# EAGLE design bb (EAGLE 6.5.0)
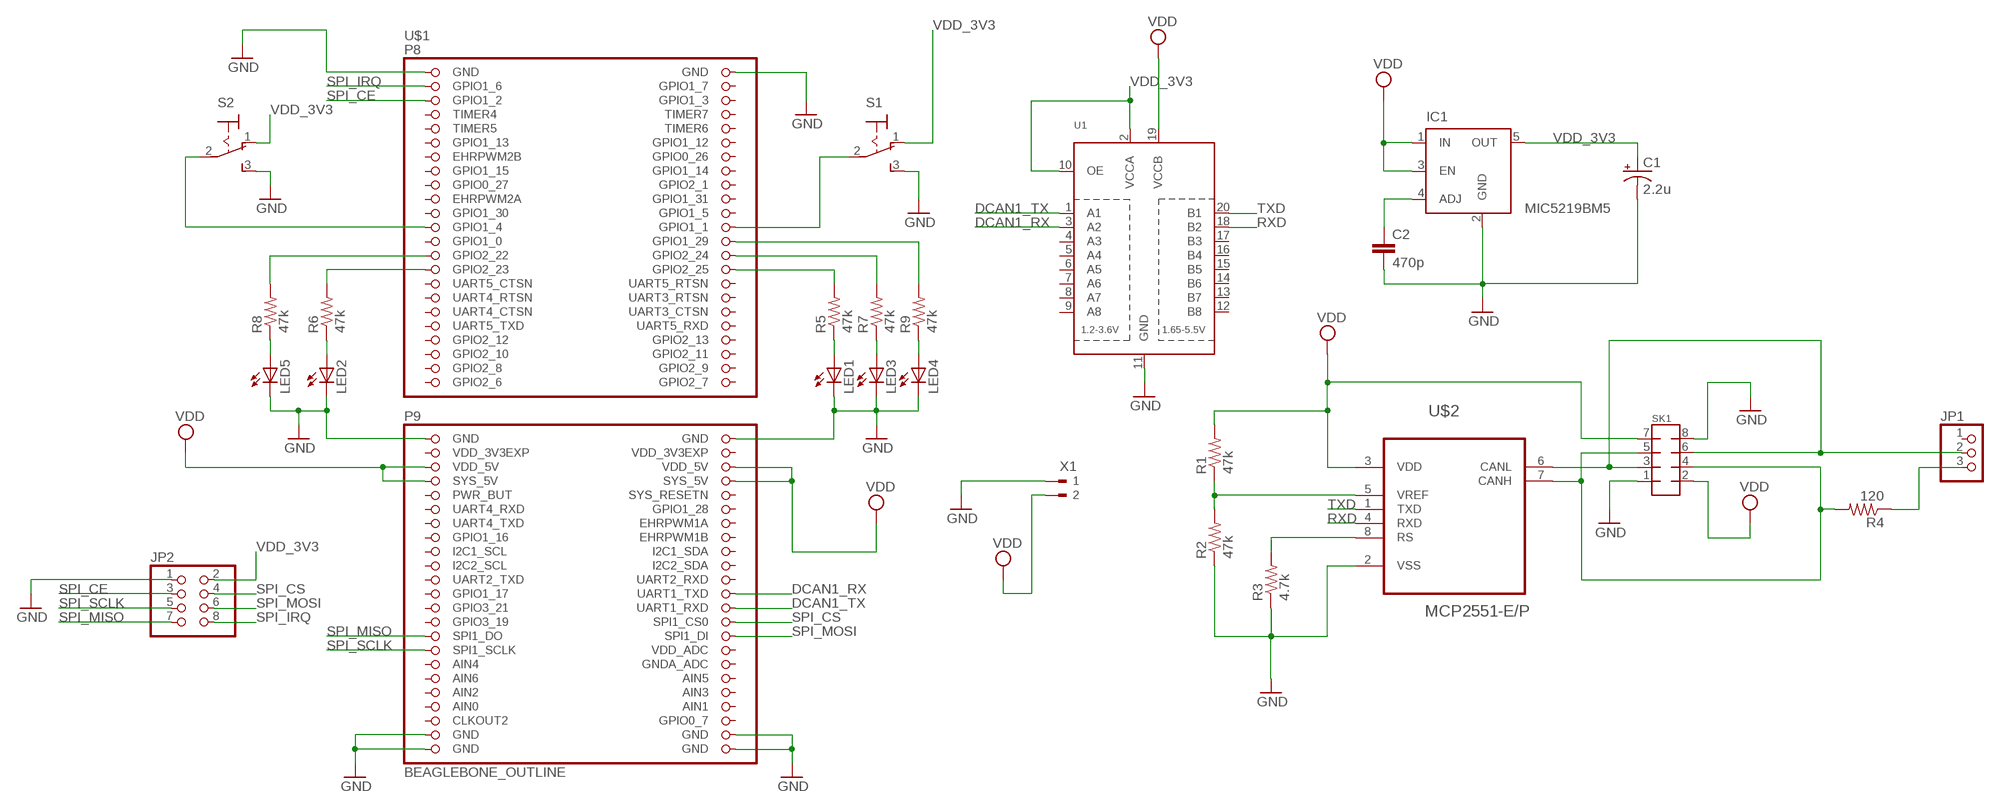
[diagram p0: schematic, sheet 1]

## Parts
C1  2.2u  CPOL-USE5-4  [E5-4]
C2  470p  C-EU025-040X050  [C025-040X050]
IC1  MIC5219BM5  [SOT23-5]
JP1  PINHD-1X3  [1X03]
JP2  PINHD-2X4  [2X04]
LED1  LED5MM  [LED5MM]
LED2  LED5MM  [LED5MM]
LED3  LED5MM  [LED5MM]
LED4  LED5MM  [LED5MM]
LED5  LED5MM  [LED5MM]
R1  47k  R-US_0207/9  [0207/9]
R2  47k  R-US_0207/9  [0207/9]
R3  4.7k  R-US_0207/9  [0207/9]
R4  120  R-US_0207/9  [0207/9]
R5  47k  R-US_0207/9  [0207/9]
R6  47k  R-US_0207/9  [0207/9]
R7  47k  R-US_0207/9  [0207/9]
R8  47k  R-US_0207/9  [0207/9]
R9  47k  R-US_0207/9  [0207/9]
S1  320-916  [320-916]
S2  320-916  [320-916]
SK1  MMATCH-8-PTH  [AMP-215079-8]
U1  TXB0108PWR  [TSSOP20]
U$1  BEAGLEBONE_OUTLINE  [BEAGLEBONE_SHIELD]
U$2  MCP2551-E/P  [DIP254P762X432-8]
X1  180G-2  [180G-2]

## Nets
DCAN1_RX: U1.3(A2) U$1.70(UART1_TXD)
DCAN1_TX: U1.1(A1) U$1.72(UART1_RXD)
GND: C1.- C2.2 IC1.2(GND) JP2.1 LED1.K(C) LED2.K(C) LED3.K(C) LED4.K(C) LED5.K(C) R2.1 R3.1 S1.3(S) S2.3(S) SK1.1 SK1.8 U1.11(GND) U$1.1(GND) U$1.2(GND) U$1.47(GND) U$1.48(GND) U$1.89(GND) U$1.90(GND) U$1.91(GND) U$1.92(GND) U$2.2(VSS) X1.1
N$1: R1.1 R2.2 U$2.5(VREF)
N$2: JP1.3 R4.1
N$3: R3.2 U$2.8(RS)
N$4: C2.1 IC1.4(ADJ)
N$5: R5.2 U$1.30(GPIO2_25)
N$6: R6.2 U$1.29(GPIO2_23)
N$7: R7.2 U$1.28(GPIO2_24)
N$9: R9.2 U$1.26(GPIO1_29)
N$10: LED5.A R8.1
N$11: S1.2(P) U$1.24(GPIO1_1)
N$12: S2.2(P) U$1.23(GPIO1_4)
N$13: R8.2 U$1.27(GPIO2_22)
N$15: JP1.2 SK1.3 SK1.6 U$2.6(CANL)
N$16: R4.2 SK1.4 SK1.5 U$2.7(CANH)
N$19: LED2.A R6.1
N$20: LED1.A R5.1
N$21: LED3.A R7.1
N$22: LED4.A R9.1
RXD: U1.18(B2) U$2.4(RXD)
SPI_CE: JP2.3 U$1.5(GPIO1_2)
SPI_CS: JP2.4 U$1.74(SPI1_CS0)
SPI_IRQ: JP2.8 U$1.3(GPIO1_6)
SPI_MISO: JP2.7 U$1.75(SPI1_DO)
SPI_MOSI: JP2.6 U$1.76(SPI1_DI)
SPI_SCLK: JP2.5 U$1.77(SPI1_SCLK)
TXD: U1.20(B1) U$2.1(TXD)
VDD: IC1.1(IN) IC1.3(EN) R1.2 SK1.2 SK1.7 U1.19(VCCB) U$1.51(VDD_5V) U$1.52(VDD_5V) U$1.53(SYS_5V) U$1.54(SYS_5V) U$2.3(VDD) X1.2
VDD_3V3: C1.+ IC1.5(OUT) JP2.2 S1.1(O) S2.1(O) U1.2(VCCA) U1.10(OE)
Unconnected: JP1.1 U1.4(A3) U1.5(A4) U1.6(A5) U1.7(A6) U1.8(A7) U1.9(A8) U1.12(B8) U1.13(B7) U1.14(B6) U1.15(B5) U1.16(B4) U1.17(B3) U$1.4(GPIO1_7) U$1.6(GPIO1_3) U$1.7(TIMER4) U$1.8(TIMER7) U$1.9(TIMER5) U$1.10(TIMER6) U$1.11(GPIO1_13) U$1.12(GPIO1_12) U$1.13(EHRPWM2B) U$1.14(GPIO0_26) U$1.15(GPIO1_15) U$1.16(GPIO1_14) U$1.17(GPIO0_27) U$1.18(GPIO2_1) U$1.19(EHRPWM2A) U$1.20(GPIO1_31) U$1.21(GPIO1_30) U$1.22(GPIO1_5) U$1.25(GPIO1_0) U$1.31(UART5_CTSN) U$1.32(UART5_RTSN) U$1.33(UART4_RTSN) U$1.34(UART3_RTSN) U$1.35(UART4_CTSN) U$1.36(UART3_CTSN) U$1.37(UART5_TXD) U$1.38(UART5_RXD) U$1.39(GPIO2_12) U$1.40(GPIO2_13) U$1.41(GPIO2_10) U$1.42(GPIO2_11) U$1.43(GPIO2_8) U$1.44(GPIO2_9) U$1.45(GPIO2_6) U$1.46(GPIO2_7) U$1.55(PWR_BUT) U$1.56(SYS_RESETN) U$1.57(UART4_RXD) U$1.58(GPIO1_28) U$1.59(UART4_TXD) U$1.60(EHRPWM1A) U$1.61(GPIO1_16) U$1.62(EHRPWM1B) U$1.63(I2C1_SCL) U$1.64(I2C1_SDA) U$1.65(I2C2_SCL) U$1.66(I2C2_SDA) U$1.67(UART2_TXD) U$1.68(UART2_RXD) U$1.69(GPIO1_17) U$1.71(GPIO3_21) U$1.73(GPIO3_19) U$1.78(VDD_ADC) U$1.79(AIN4) U$1.80(GNDA_ADC) U$1.81(AIN6) U$1.82(AIN5) U$1.83(AIN2) U$1.84(AIN3) U$1.86(AIN1) U$1.87(CLKOUT2) U$1.88(GPIO0_7)

## Power pins joined to a net without a drawn wire
AIN0: U$1.85(AIN0)
VDD_3V3EXP: U$1.49(VDD_3V3EXP) U$1.50(VDD_3V3EXP)

## Library data of the parts
C1 = resistor:CPOL-US: POLARIZED CAPACITOR, American symbol
C2 = resistor:C-EU: CAPACITOR, European symbol
IC1 = v-reg-micrel:MIC5219BM5: VOLTAGE REGULATOR; MF: ALTERA CORPORATION; MPN: MIC5219BM5 TR; OC_FARNELL: 1100656; OC_NEWARK: 09J8939
JP1 = adafruit:PINHD-1X3: PIN HEADER
JP2 = adafruit:PINHD-2X4: PIN HEADER
LED1-LED5 = adafruit:LED: LED OSRAM: - CHIPLED LG R971, LG N971, LY N971, LG Q971, LY Q971, LO R971, LY R971 LH N974, LH R974 LS Q976, LO Q976, LY Q976 LO Q996 - Hyper CHIPLED LW Q18S LB Q993, LB Q99A, LB R99A - SideLED LS A670, LO A670, LY A670, LG A670, LP A670 LB A673, LV A673, LT A673, LW A673 LH A674 LY A675 LS A676, LA A676, LO A676, LY A676, LW A676 LS A679, LY A679, LG A679 - Hyper Micro SIDELED® LS Y876, LA Y876, LO Y876, LY Y876 LT Y87S - SmartLED LW L88C, LW L88S LB L89C, LB L89S, LG L890 LS L89K, LO L89K, LY L89K LS L896, LA L896, LO L896, LY L896 - TOPLED LS T670, LO T670, LY T670, LG T670, LP T670 LSG T670, LSP T670, LSY T670, LOP T670, LYG T670 LG T671, LOG T671, LSG T671 LB T673, LV T673, LT T673, LW T673 LH T674 LS T676, LA T676, LO T676, LY T676, LB T676, LH T676, LSB T676, LW T676 LB T67C, LV T67C, LT T67C, LS T67K, LO T67K, LY T67K, LW E67C LS E67B, LA E67B, LO E67B, LY E67B, LB E67C, LV E67C, LT E67C LW T67C LS T679, LY T679, LG T679 LS T770, LO T770, LY T770, LG T770, LP T770 LB T773, LV T773, LT T773, LW T773 LH T774 LS E675, LA E675, LY E675, LS T675 LS T776, LA T776, LO T776, LY T776, LB T776 LHGB T686 LT T68C, LB T68C - Hyper Mini TOPLED® LB M676 - Mini TOPLED Santana® LG M470 LS M47K, LO M47K, LY M47K Source: http://www.osram.convergy.de/
R1-R9 = adafruit:R-US_: RESISTOR, American symbol
S1 S2 = switch:320-916: TOGGLE SWITCH distributor RS Components
SK1 = jt-con-micromatch:MMATCH-8-*: AMP Micromatch 8-pin
U1 = adafruit:TXB0108PWR: 8-Bit Bi-Directional Level Shifter 1.2V-3.6V (VCCA) to 1.65V-5.5V (VCCB) bi-directional level shifter with auto direction sensing. Max data rate - VCCA 1.8V: 20Mbps (50ns), VCCA 3.3V: 100Mbps (10ns) Digikey: 296-21527-1-ND
U$1 = adafruit:BEAGLEBONE_OUTLINE: Should match A3 pinout - but not completely tested
U$2 = mcp2551:MCP2551-E/P: High-Speed CAN Transceiver; MPN: MCP2551-E/P; OC_FARNELL: 1439745; OC_NEWARK: 69K7603; PACKAGE: DIP-8; SUPPLIER: Microchip
X1 = con-weidmueller-sl35:180G-2: WEIDMUELLER CLAMP CONNECTOR; OC_FARNELL: unknown; OC_NEWARK: unknown

## Board
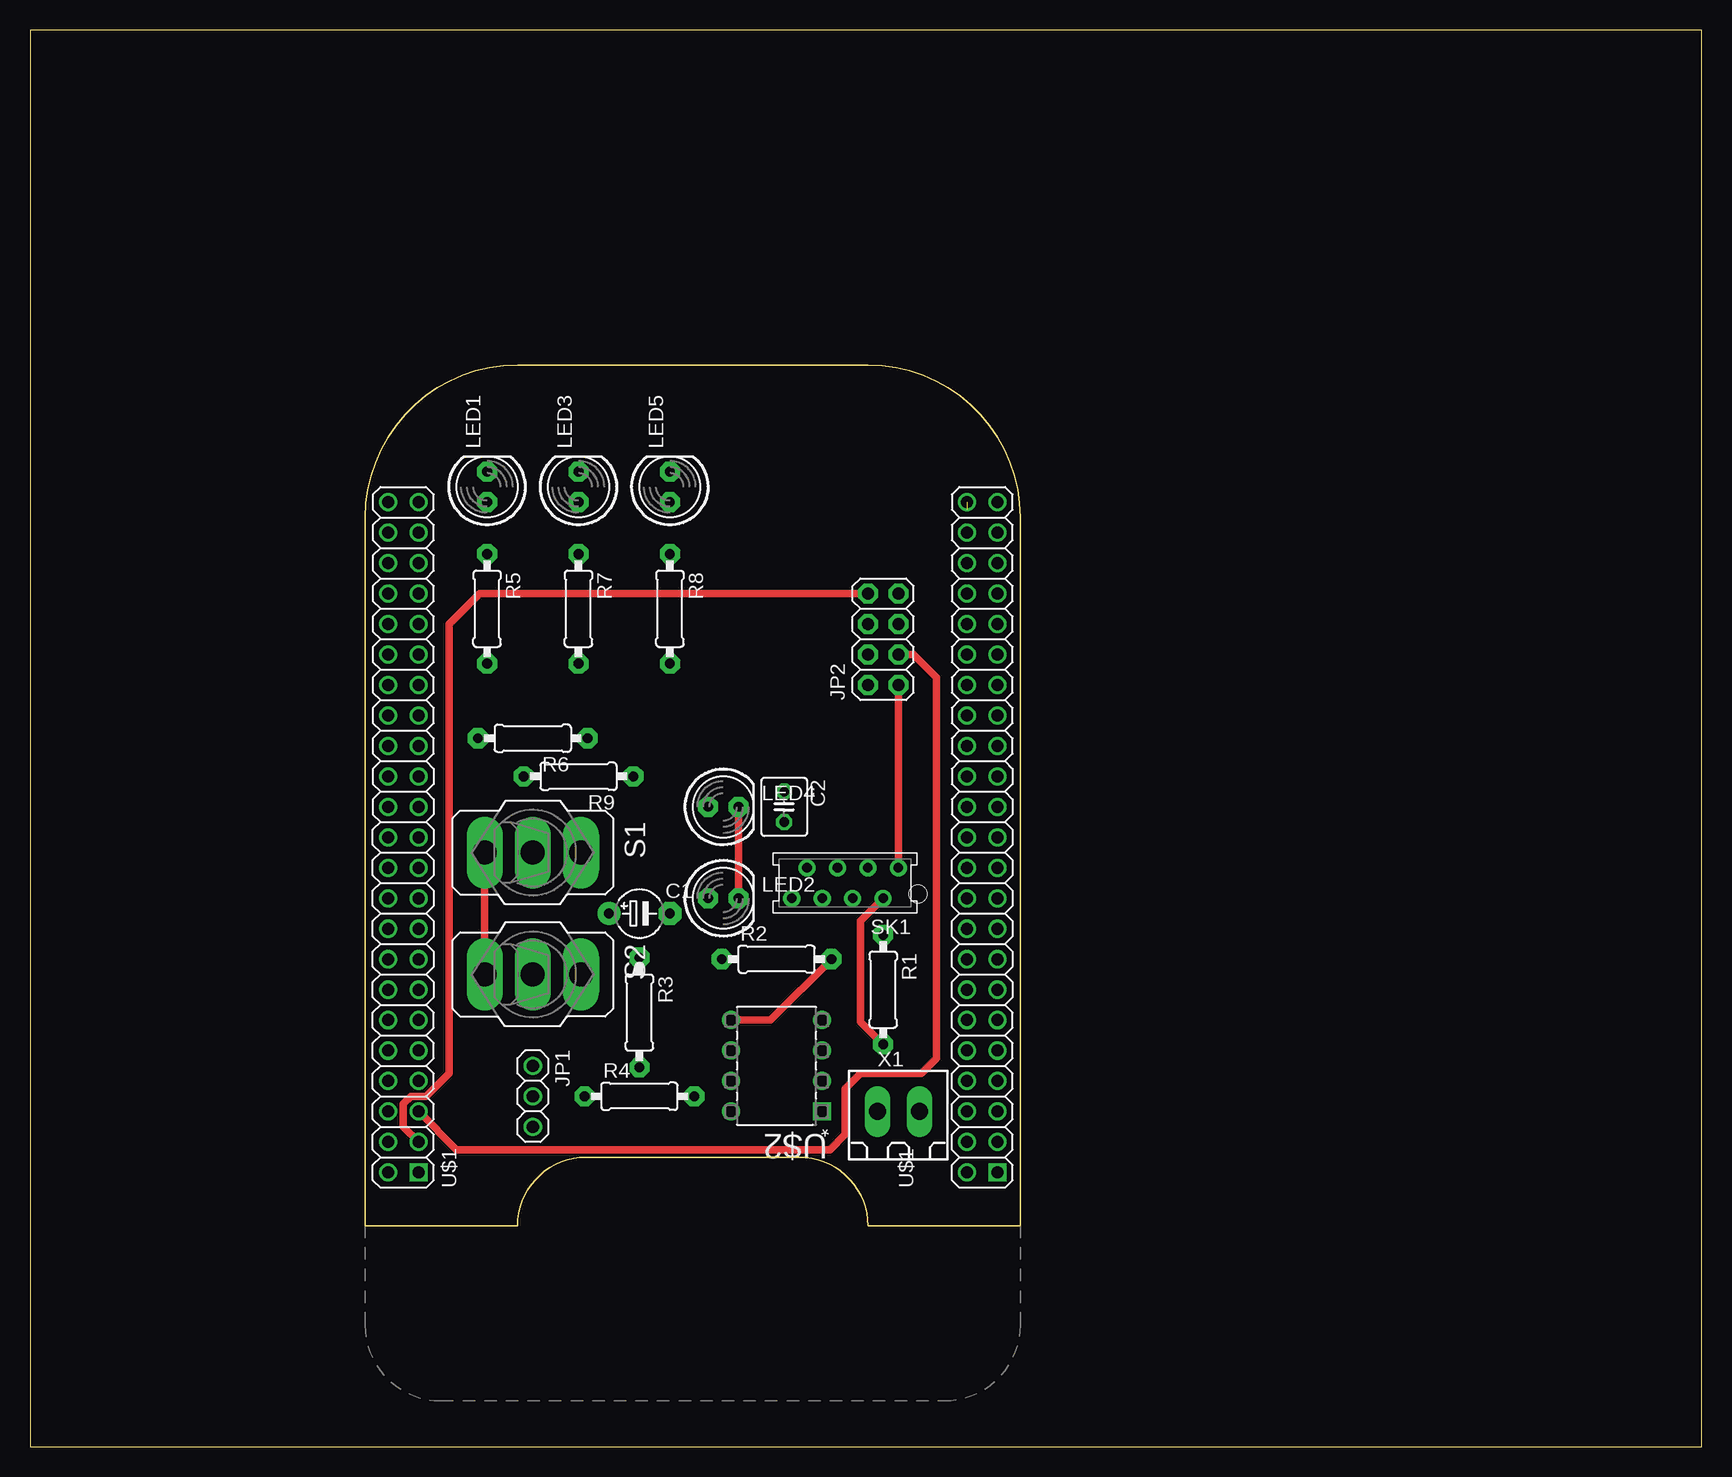
[diagram p1: board, top side]
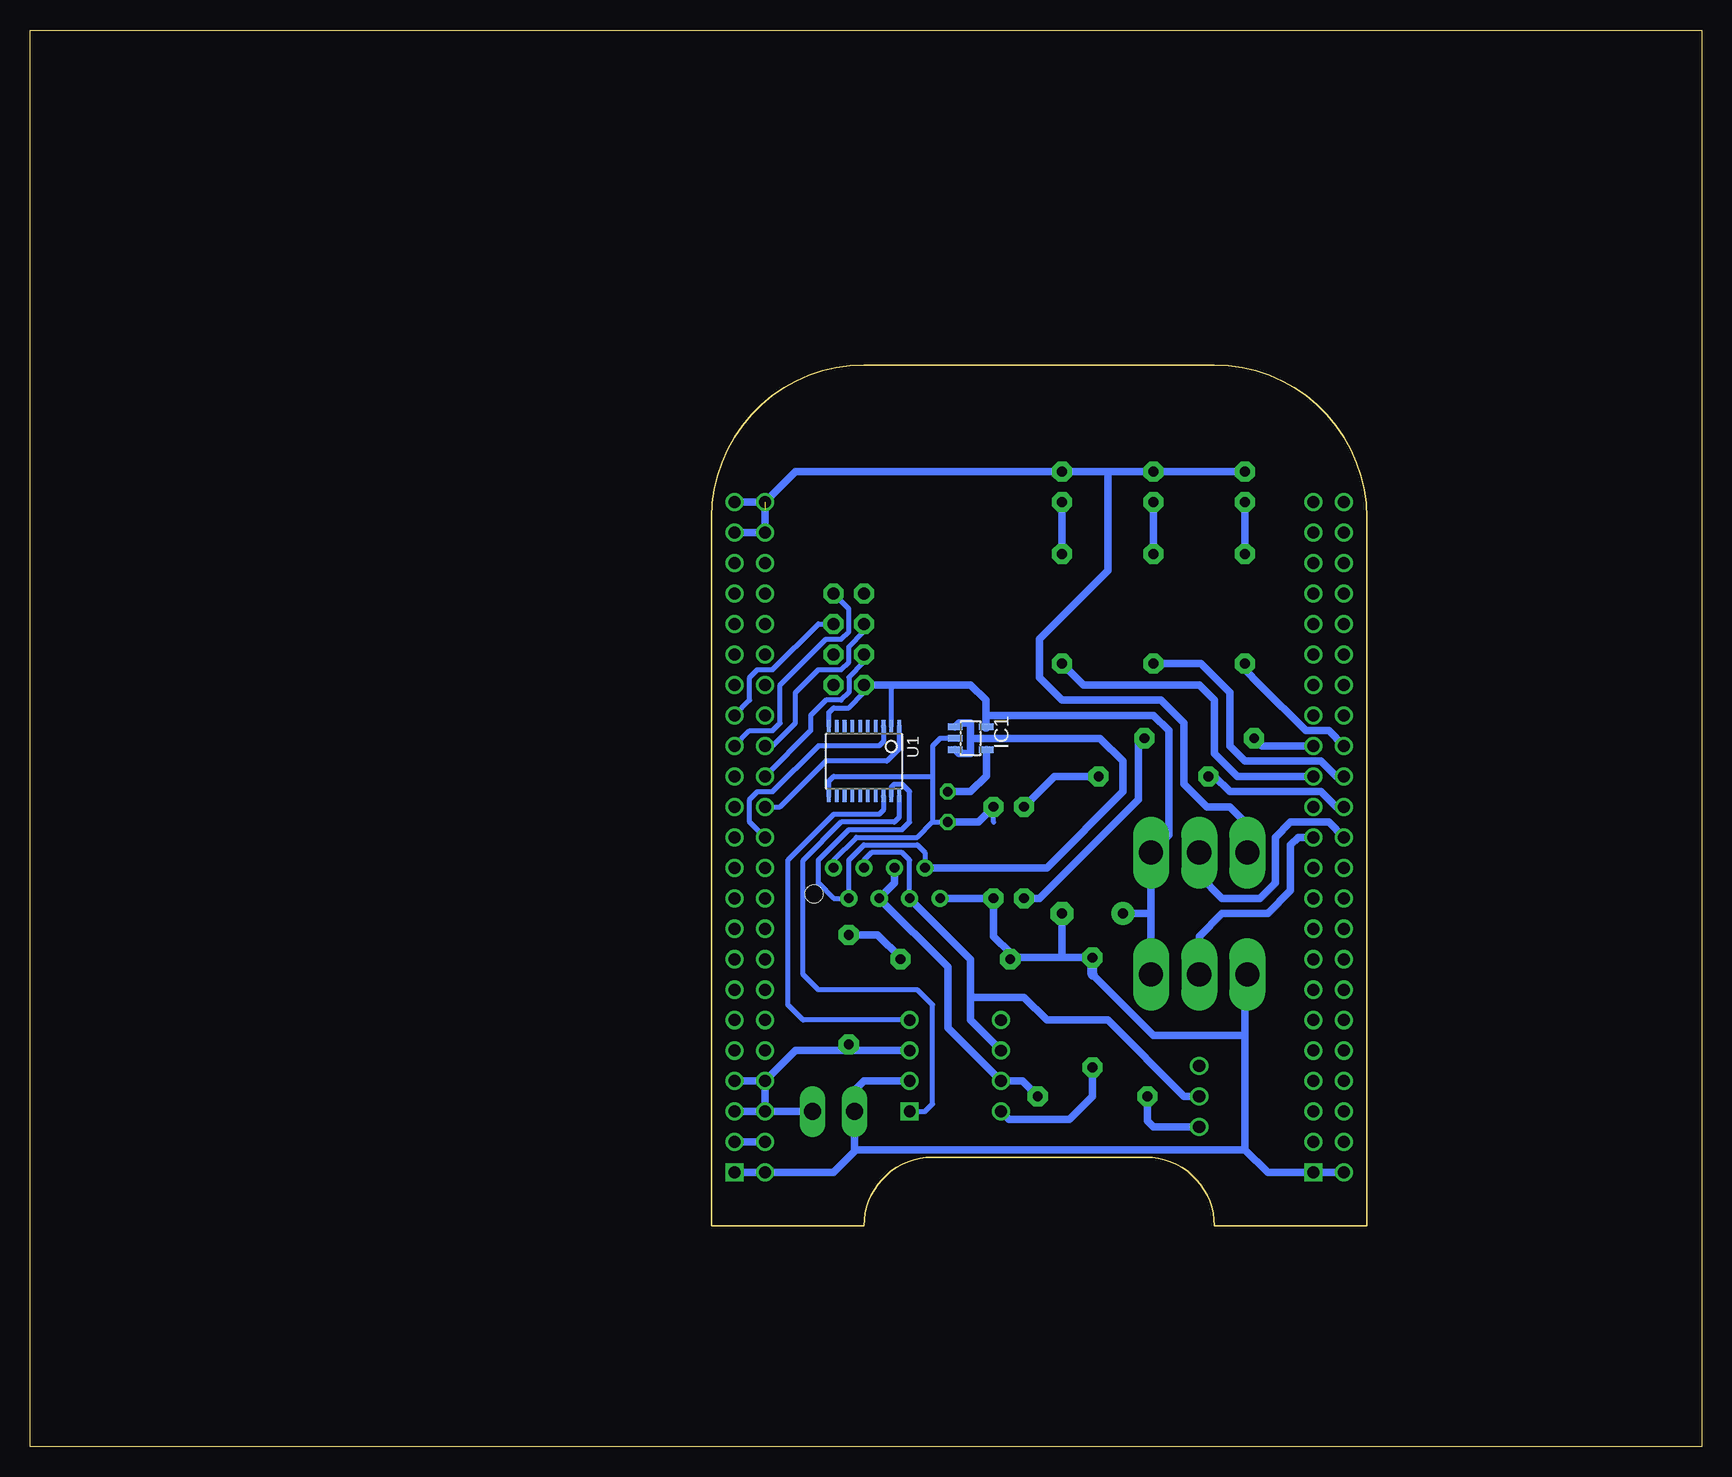
[diagram p2: board, bottom side, seen from below]

Size 139.37 x 118.1 mm. Coordinates in mm from the lower left corner, seen from the top.
Outline: 0,0 139.37,0 139.37,118.1 0,118.1 0,0
Copper layers (1*16): Top 0.035mm / dielectric 1.5mm / Bottom 0.035mm
Design rules "default": minimum track width 10mil, minimum drill 24mil, track to track 8mil, track to pad 8mil, pad to pad 8mil, via to via 8mil, smd to smd 8mil, copper to edge 40mil, drill to drill 8mil, minimum pad ring 10mil, minimum via ring 8mil, stop-mask expansion 4mil, vias tented up to drill 0mil, thermal gap 10mil

### Footprints (pad centres in the part's own frame; a part is rotated, then mirrored left to right if it is on the bottom)
E5-4 = drill 0.813 pad 1.905: + -2.54,0 | drill 0.813 pad 1.905 octagon: - 2.54,0
C025-040X050 = drill 0.813 octagon: 1 -1.27,0; 2 1.27,0
SOT23-5 = smd 0.55 x 1.2: 1 -0.95,-1.3; 2 0,-1.3; 3 0.95,-1.3; 4 0.95,1.3; 5 -0.95,1.3
1X03 = drill 1.016: 1 -2.54,0; 2 0,0; 3 2.54,0
2X04 = drill 1.016 pad 1.676 octagon: 1 -3.81,-1.27; 2 -3.81,1.27; 3 -1.27,-1.27; 4 -1.27,1.27; 5 1.27,-1.27; 6 1.27,1.27; 7 3.81,-1.27; 8 3.81,1.27
LED5MM = drill 0.813 pad 1.676 octagon: A -1.27,0; K 1.27,0
0207/9 = drill 0.813 pad 1.676 octagon: 1 -4.572,0; 2 4.572,0
320-916 = drill 2.007 long: 1 0,4.013; 2 0,0; 3 0,-4.013
AMP-215079-8 = drill 0.8 pad 1.422: 1 0,-1.27; 2 1.27,1.27; 3 2.54,-1.27; 4 3.81,1.27; 5 5.08,-1.27; 6 6.35,1.27; 7 7.62,-1.27; 8 8.89,1.27 | hole 1.5: -1.62,0.905
TSSOP20 = smd 0.305 x 0.991: 1 -2.925,-2.918; 2 -2.275,-2.918; 3 -1.625,-2.918; 4 -0.975,-2.918; 5 -0.325,-2.918; 6 0.325,-2.918; 7 0.975,-2.918; 8 1.625,-2.918; 9 2.275,-2.918; 10 2.925,-2.918; 11 2.925,2.918; 12 2.275,2.918; 13 1.625,2.918; 14 0.975,2.918; 15 0.325,2.918; 16 -0.325,2.918; 17 -0.975,2.918; 18 -1.625,2.918; 19 -2.275,2.918; 20 -2.925,2.918
BEAGLEBONE_SHIELD = drill 1 square: 1 4.445,19.05; 47 52.705,19.05 | drill 1: 2 1.905,19.05; 3 4.445,21.59; 4 1.905,21.59; 5 4.445,24.13; 6 1.905,24.13; 7 4.445,26.67; 8 1.905,26.67; 9 4.445,29.21; 10 1.905,29.21; 11 4.445,31.75; 12 1.905,31.75; 13 4.445,34.29; 14 1.905,34.29; 15 4.445,36.83; 16 1.905,36.83; 17 4.445,39.37; 18 1.905,39.37; 19 4.445,41.91; 20 1.905,41.91; 21 4.445,44.45; 22 1.905,44.45; 23 4.445,46.99; 24 1.905,46.99; 25 4.445,49.53; 26 1.905,49.53; 27 4.445,52.07; 28 1.905,52.07; 29 4.445,54.61; 30 1.905,54.61; 31 4.445,57.15; 32 1.905,57.15; 33 4.445,59.69; 34 1.905,59.69; 35 4.445,62.23; 36 1.905,62.23; 37 4.445,64.77; 38 1.905,64.77; 39 4.445,67.31; 40 1.905,67.31; 41 4.445,69.85; 42 1.905,69.85; 43 4.445,72.39; 44 1.905,72.39; 45 4.445,74.93; 46 1.905,74.93; 48 50.165,19.05; 49 52.705,21.59; 50 50.165,21.59; 51 52.705,24.13; 52 50.165,24.13; 53 52.705,26.67; 54 50.165,26.67; 55 52.705,29.21; 56 50.165,29.21; 57 52.705,31.75; 58 50.165,31.75; 59 52.705,34.29; 60 50.165,34.29; 61 52.705,36.83; 62 50.165,36.83; 63 52.705,39.37; 64 50.165,39.37; 65 52.705,41.91; 66 50.165,41.91; 67 52.705,44.45; 68 50.165,44.45; 69 52.705,46.99; 70 50.165,46.99; 71 52.705,49.53; 72 50.165,49.53; 73 52.705,52.07; 74 50.165,52.07; 75 52.705,54.61; 76 50.165,54.61; 77 52.705,57.15; 78 50.165,57.15; 79 52.705,59.69; 80 50.165,59.69; 81 52.705,62.23; 82 50.165,62.23; 83 52.705,64.77; 84 50.165,64.77; 85 52.705,67.31; 86 50.165,67.31; 87 52.705,69.85; 88 50.165,69.85; 89 52.705,72.39; 90 50.165,72.39; 91 52.705,74.93; 92 50.165,74.93
DIP254P762X432-8 = drill 0.991 square: 1 -7.62,7.62 | drill 0.991: 2 -7.62,5.08; 3 -7.62,2.54; 4 -7.62,0; 5 0,0; 6 0,2.54; 7 0,5.08; 8 0,7.62
180G-2 = drill 1.422 long: 1 -1.75,0; 2 1.75,0

### Placement (x,y rotation side)
C1  50.8,44.45 0 top
C2  62.87,53.34 270 top
IC1  60.96,59.05 270 bottom
JP1  41.91,29.21 270 top
JP2  71.12,67.31 90 top
LED1  38.1,80.01 90 top
LED2  57.78,45.72 0 top
LED3  45.72,80.01 90 top
LED4  57.78,53.34 0 top
LED5  53.34,80.01 90 top
R1  71.12,38.1 270 top
R2  62.23,40.64 0 top
R3  50.8,36.2 270 top
R4  50.8,29.21 0 top
R5  38.1,69.85 270 top
R6  41.91,59.05 180 top
R7  45.72,69.85 270 top
R8  53.34,69.85 270 top
R9  45.72,55.88 180 top
S1  41.91,49.53 270 top
S2  41.91,39.37 270 top
SK1  72.39,46.99 180 top
U1  69.85,57.15 180 bottom
U$1  27.94,3.81 0 top
U$2  58.42,35.56 180 top
X1  72.39,27.94 0 top

### Tracks (layer width: path | path; a pad name or v marks a point on that pad's centre or on a via)
DCAN1_RX
  Bottom 0.406: U$1.70 79.38,52.07 79.38,53.98 78.74,54.61 77.47,54.61 73.66,58.42 68.58,58.42 68.22,58.77 U1.3
DCAN1_TX
  Bottom 0.406: U$1.72 76.83,53.34 73.03,57.15 67.94,57.15 66.92,58.17 U1.1
GND  (1 unrouted)
  Top 0.61: JP2.1 SK1.1 | LED2.K LED4.K | S1.3 S2.3
  Bottom 0.406: 59.05,52.07 LED4.K | 64.14,52.07 65.41,50.8 70.48,50.8 72.39,48.9 SK1.1 | IC1.2 63.5,59.05 64.14,58.42 64.14,55.88 | 64.14,55.88 64.14,52.07 | 64.14,52.07 C2.2 | U1.11 72.78,55.49 72.39,55.88 64.14,55.88
  Bottom 0.61: LED1.K LED3.K 49.53,81.28 | 49.53,81.28 LED5.K 75.56,81.28 U$1.92 U$1.91 | SK1.8 LED2.K 59.05,42.55 57.66,41.15 | 53.34,40.77 57.53,40.77 | U$2.2 69.85,30.48 70.64,29.69 X1.1 70.64,24.77 | C1.- 53.34,40.77 | 53.34,40.77 51.44,40.77 | U$1.47 U$1.48 72.39,22.86 70.64,24.61 70.64,24.77 | 78.11,78.11 U$1.90 U$1.89 | U$1.2 U$1.1 36.2,22.86 38.1,24.77 | S1.3 37.9,51.87 39.37,53.34 41.27,53.34 43.18,55.24 43.18,60.33 45.09,62.23 53.34,62.23 55.24,64.14 55.24,67.31 49.53,73.03 49.53,81.28 | 50.8,39.37 45.72,34.29 38.1,34.29 | S2.3 38.1,39.17 38.1,34.29 | 70.64,24.77 38.1,24.77 | 38.1,34.29 38.1,24.77 | C2.2 60.33,52.07 LED4.K
  Bottom 0.813: 57.53,40.77 R2.1 57.66,41.15 | R3.1 51.44,40.77 50.8,40.13 50.8,39.37
N$1
  Top 0.61: U$2.5 61.72,35.56 R2.2
  Bottom 0.61: 66.8,40.77 68.71,42.67 R1.1
  Bottom 0.813: R2.2 66.8,40.77
N$2
  Bottom 0.61: JP1.3 45.72,26.67 46.23,27.18 R4.1
N$3
  Bottom 0.61: U$2.8 57.78,27.3 52.7,27.3 50.8,29.21 R3.2
N$4
  Bottom 0.61: C2.1 60.96,54.61 59.66,55.91 IC1.4
N$5
  Bottom 0.61: R5.2 38.1,64.77 36.83,63.5 33.02,59.69 31.11,59.69 U$1.30
N$6
  Bottom 0.61: U$1.29 36.7,58.42 R6.2
N$7
  Bottom 0.61: U$1.28 30.48,55.88 31.75,57.15 38.1,57.15 39.37,58.42 39.37,62.87 41.78,65.28 R7.2
N$9
  Bottom 0.61: U$1.26 30.48,53.34 31.75,54.61 39.37,54.61 40.64,55.88 R9.2
N$10
  Bottom 0.61: R8.1 LED5.A
N$11
  Bottom 0.61: S1.2 41.91,47.62 40.01,45.72 36.83,45.72 35.56,46.99 35.56,50.8 34.29,52.07 31.11,52.07 U$1.24
N$12
  Bottom 0.61: S2.2 41.91,42.55 40.01,44.45 36.2,44.45 34.29,46.35 34.29,50.16 33.66,50.8 U$1.23
N$13
  Bottom 0.61: U$1.27 38.73,55.88 40.64,57.78 40.64,62.23 41.91,63.5 51.56,63.5 R8.2
N$15
  Bottom 0.406: SK1.6 66.04,48.9 66.67,49.53 69.22,49.53 69.85,48.9 SK1.3
  Bottom 0.61: U$2.6 60.96,35.56 60.96,37.47 | 60.96,37.47 60.96,40.64 SK1.6 | JP1.2 43.18,29.21 49.53,35.56 54.61,35.56 56.52,37.47 60.96,37.47
N$16
  Bottom 0.61: SK1.5 67.31,46.99 SK1.4 62.87,40.01 62.87,34.92 U$2.7 56.64,30.48 R4.2
N$19
  Bottom 0.61: LED2.A 55.24,45.72 46.99,53.98 46.99,58.55 R6.1
N$20
  Bottom 0.61: R5.1 LED1.A
N$21
  Bottom 0.61: R7.1 LED3.A
N$22
  Bottom 0.61: R9.1 53.98,55.88 LED4.A
RXD
  Bottom 0.406: U$2.4 74.93,35.56 76.2,36.83 76.2,48.9 72.39,52.7 68.58,52.7 68.22,53.06 U1.18
SPI_CE
  Top 0.61: JP2.3 73.66,66.04 75.56,64.14 75.56,32.38 74.3,31.11 69.22,31.11 67.94,29.84 67.94,26.04 66.67,24.77 35.56,24.77 U$1.5
SPI_CS
  Bottom 0.406: JP2.4 69.85,65.41 71.12,64.14 71.12,62.87 71.75,62.23 73.03,62.23 74.3,60.96 74.3,59.69 U$1.74
SPI_IRQ
  Top 0.61: U$1.3 31.11,26.67 31.11,28.57 31.75,29.21 33.02,29.21 34.92,31.11 34.92,68.58 37.47,71.12 JP2.8
SPI_MISO
  Bottom 0.406: U$1.75 79.38,59.69 77.47,59.69 76.83,60.33 76.83,63.5 73.03,67.31 71.75,67.31 71.12,67.94 71.12,69.85 JP2.7
SPI_MOSI
  Bottom 0.406: U$1.76 77.47,58.42 75.56,60.33 75.56,62.87 73.66,64.77 71.75,64.77 71.12,65.41 71.12,66.67 69.85,67.94 JP2.6
SPI_SCLK
  Bottom 0.406: U$1.77 79.38,62.23 79.38,64.14 78.74,64.77 77.47,64.77 73.66,68.58 JP2.5
TXD
  Bottom 0.406: U$2.1 64.77,27.94 64.14,28.57 64.14,36.83 65.41,38.1 73.66,38.1 74.93,39.37 74.93,48.89 71.75,52.07 67.31,52.07 66.92,52.45 U1.20
VDD
  Top 0.61: SK1.2 69.22,43.81 69.22,35.43 R1.2
  Bottom 0.406: SK1.7 64.77,49.53 65.41,50.16 69.85,50.16 71.12,48.9 SK1.2 72.39,45.72 73.66,46.99 73.66,48.9 71.12,51.44 66.67,51.44 66.04,52.07 66.04,54.61 66.67,55.24 67.31,55.24 67.58,54.98 U1.19
  Bottom 0.61: U$1.53 U$1.54 | U$1.52 U$1.54 | U$1.51 U$1.52 | U$1.52 X1.2 | 60.96,59.05 60.96,57.78 61.94,57.78 IC1.3 | 60.96,59.05 50.16,59.05 48.26,57.15 48.26,54.61 54.61,48.26 SK1.7 | 60.96,59.05 60.96,60.33 61.94,60.33 IC1.1 | U$2.3 71.25,33.02 | 71.25,33.02 R1.2 | 71.25,33.02 75.56,33.02 U$1.54
VDD_3V3
  Bottom 0.406: IC1.5 59.3,60.01 | U1.10 72.78,61.21 72.39,61.59 71.12,61.59 69.85,62.87 JP2.2 | U1.2 67.58,63.23 67.31,63.5
  Bottom 0.61: S2.1 45.92,44.45 | 45.92,44.45 S1.1 44.45,51 44.45,59.69 45.72,60.96 59.69,60.96 | C1.+ 45.92,44.45 | JP2.2 67.31,63.5 60.96,63.5 59.69,62.23 59.69,60.96 | 59.69,60.96 59.69,60.03
  Bottom 0.813: 59.69,60.03 IC1.5
VDD_3V3EXP
  Bottom 0.61: U$1.50 U$1.49